# EAGLE design Ex Female To Female (EAGLE 7.6.0)
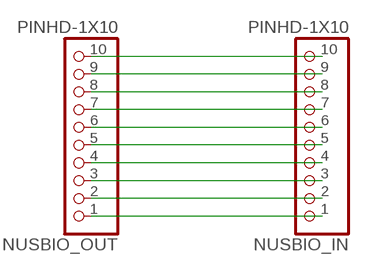
[diagram p0: schematic, sheet 1]

## Parts
NUSBIO_IN  PINHD-1X10  [1X10-BIG]
NUSBIO_OUT  PINHD-1X10  [1X10-BIG]

## Nets
N$1: NUSBIO_IN.1 NUSBIO_OUT.1
N$2: NUSBIO_IN.2 NUSBIO_OUT.2
N$3: NUSBIO_IN.3 NUSBIO_OUT.3
N$4: NUSBIO_IN.4 NUSBIO_OUT.4
N$5: NUSBIO_IN.5 NUSBIO_OUT.5
N$6: NUSBIO_IN.6 NUSBIO_OUT.6
N$7: NUSBIO_IN.7 NUSBIO_OUT.7
N$8: NUSBIO_IN.8 NUSBIO_OUT.8
N$9: NUSBIO_IN.9 NUSBIO_OUT.9
N$10: NUSBIO_IN.10 NUSBIO_OUT.10

## Library data of the parts
NUSBIO_IN NUSBIO_OUT = adafruit:PINHD-1X10: Pin header 1x10 0.1" spacing With round pins

## Board
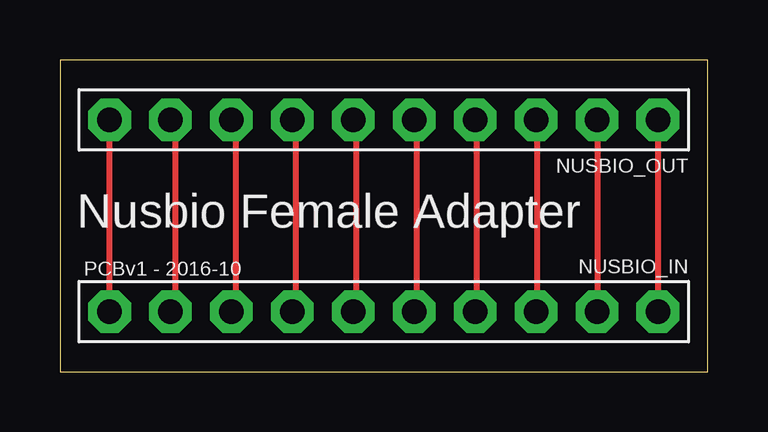
[diagram p1: board, top side]

Size 27 x 13 mm. Coordinates in mm from the lower left corner, seen from the top.
Outline: 0,0 27,0 27,13 0,13 0,0
Copper layers (1*16): Top 0.035mm / dielectric 1.5mm / Bottom 0.035mm
Design rules "default": minimum track width 10mil, minimum drill 24mil, track to track 8mil, track to pad 8mil, pad to pad 8mil, via to via 8mil, smd to smd 8mil, copper to edge 40mil, drill to drill 8mil, minimum pad ring 10mil, minimum via ring 8mil, stop-mask expansion 4mil, vias tented up to drill 0mil, thermal gap 10mil

### Footprints (pad centres in the part's own frame; a part is rotated, then mirrored left to right if it is on the bottom)
1X10-BIG = drill 1.016 pad 1.778 octagon: 1 -11.43,0; 2 -8.89,0; 3 -6.35,0; 4 -3.81,0; 5 -1.27,0; 6 1.27,0; 7 3.81,0; 8 6.35,0; 9 8.89,0; 10 11.43,0

### Placement (x,y rotation side)
NUSBIO_IN  13.5,2.5 180 top
NUSBIO_OUT  13.5,10.5 180 top

### Tracks (layer width: path | path; a pad name or v marks a point on that pad's centre or on a via)
N$1
  Top 0.254: NUSBIO_IN.1 24.92,2.52 24.92,10.29 NUSBIO_OUT.1
N$2
  Top 0.254: NUSBIO_IN.2 22.4,2.52 22.4,10.29 NUSBIO_OUT.2
N$3
  Top 0.254: NUSBIO_IN.3 19.89,2.52 19.89,10.29 NUSBIO_OUT.3
N$4
  Top 0.254: NUSBIO_IN.4 17.37,2.52 17.37,10.29 NUSBIO_OUT.4
N$5
  Top 0.254: NUSBIO_IN.5 14.86,2.52 14.86,10.29 NUSBIO_OUT.5
N$6
  Top 0.254: NUSBIO_IN.6 12.34,2.52 12.34,10.29 NUSBIO_OUT.6
N$7
  Top 0.254: NUSBIO_IN.7 9.83,2.52 9.83,10.29 NUSBIO_OUT.7
N$8
  Top 0.254: NUSBIO_IN.8 7.32,2.52 7.32,10.29 NUSBIO_OUT.8
N$9
  Top 0.254: NUSBIO_IN.9 4.8,2.52 4.8,10.29 NUSBIO_OUT.9
N$10
  Top 0.254: NUSBIO_IN.10 2.06,2.52 2.06,10.29 NUSBIO_OUT.10

### Text on the board
tNames: Nusbio Female Adapter | PCBv1 - 2016-10
bNames: MadeInTheUSB.net